# EAGLE schematic untitled (EAGLE 6.1)
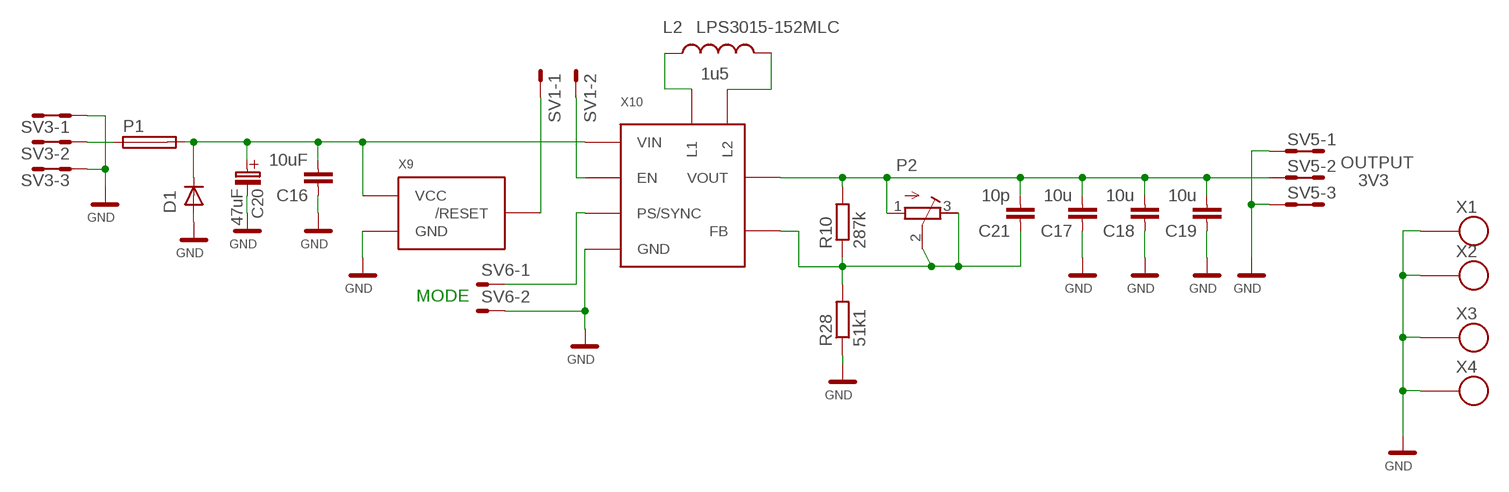
[diagram p0: schematic, sheet 1]

## Parts
C16  10uF  C0805  [C0805]
C17  10u  C0805  [C0805]
C18  10u  C0805  [C0805]
C19  10u  C0805  [C0805]
C20  47uF  B  [B]
C21  10p  C0603  [0603]
D1  D-OB.SMA  [SMA]
L2  LPS3015-152MLC  LPS3015  [LPS3015]
P1  POJISTKA_1812  [1812]
P2  TRIM_CA9MTV10  [TRIM_CA9MTV10]
R10  287k  R0603  [0603]
R28  51k1  R0603  [0603]
SV1  MA02-1  [MA02-1]
SV3  MA03-2  [MA03-2]
SV5  MA03-2  [MA03-2]
SV6  MA02-1  [MA02-1]
X1  SROUB3M  [SROUB3M]
X2  SROUB3M  [SROUB3M]
X3  SROUB3M  [SROUB3M]
X4  SROUB3M  [SROUB3M]
X9  APX809-26SA  [SOT23]
X10  TPS63036  [DSBGA8]

## Nets
+BAT2: C16.2 C20.+(C_EL+) D1.K(C) P1.2 X9.3(VCC) X10.A1(VIN)
GND: C16.1 C17.1 C18.1 C19.1 C20.-(C_EL-) D1.A R28.1 SV3.1 SV3.2 SV3.5 SV3.6 SV5.1 SV5.2 SV5.5 SV5.6 SV6.2 X1.P$1 X2.P$1 X3.P$1 X4.P$1 X9.1(GND) X10.C2(GND)
N$1: SV1.1 X9.2(/RESET)
N$3: SV1.2 X10.A2(EN)
N$4: P1.1 SV3.3 SV3.4
N$19: L2.1-1 L2.1-2 L2.1-3 X10.B1(L1)
N$21: SV6.1 X10.B2(PS/SYNC)
N$26: L2.2-1 L2.2-2 L2.2-3 X10.C1(L2)
N$31: C17.2 C18.2 C19.2 C21.2 P2.1 R10.2 SV5.3 SV5.4 X10.D1(VOUT)
N$32: C21.1 P2.2 P2.3 R10.1 R28.2 X10.D2(FB)

## Notes on the sheet
- 1u5
- OUTPUT
- 3V3
- MODE

## Library data of the parts
C16-C19 = moje_C:C0805
C20 = moje_C:B
C21 = moje_C:C0603
D1 = moje:D-OB.SMA: SMA
L2 = moje_L:LPS3015
P1 = moje:POJISTKA_1812: Pojistka s pouzdrem 1812
P2 = moje_pot:TRIM_CA9MTV10
R10 R28 = moje_R:R0603
SV1 SV6 = moje_hrebinky:MA02-1
SV3 SV5 = moje_hrebinky:MA03-2: PIN HEADER; OC_FARNELL: unknown; OC_NEWARK: unknown
X1-X4 = moje:SROUB3M
X9 = moje_io:APX809-26SA
X10 = moje_io:TPS63036